# EasyEDA schematic 1-Schematic_PCB__Board.json
TITLE: Project Red Fir; REV: 1.0; Date: 2025-08-22; Sheet: 1/1; Drawn By: Youness; Company: semiQa
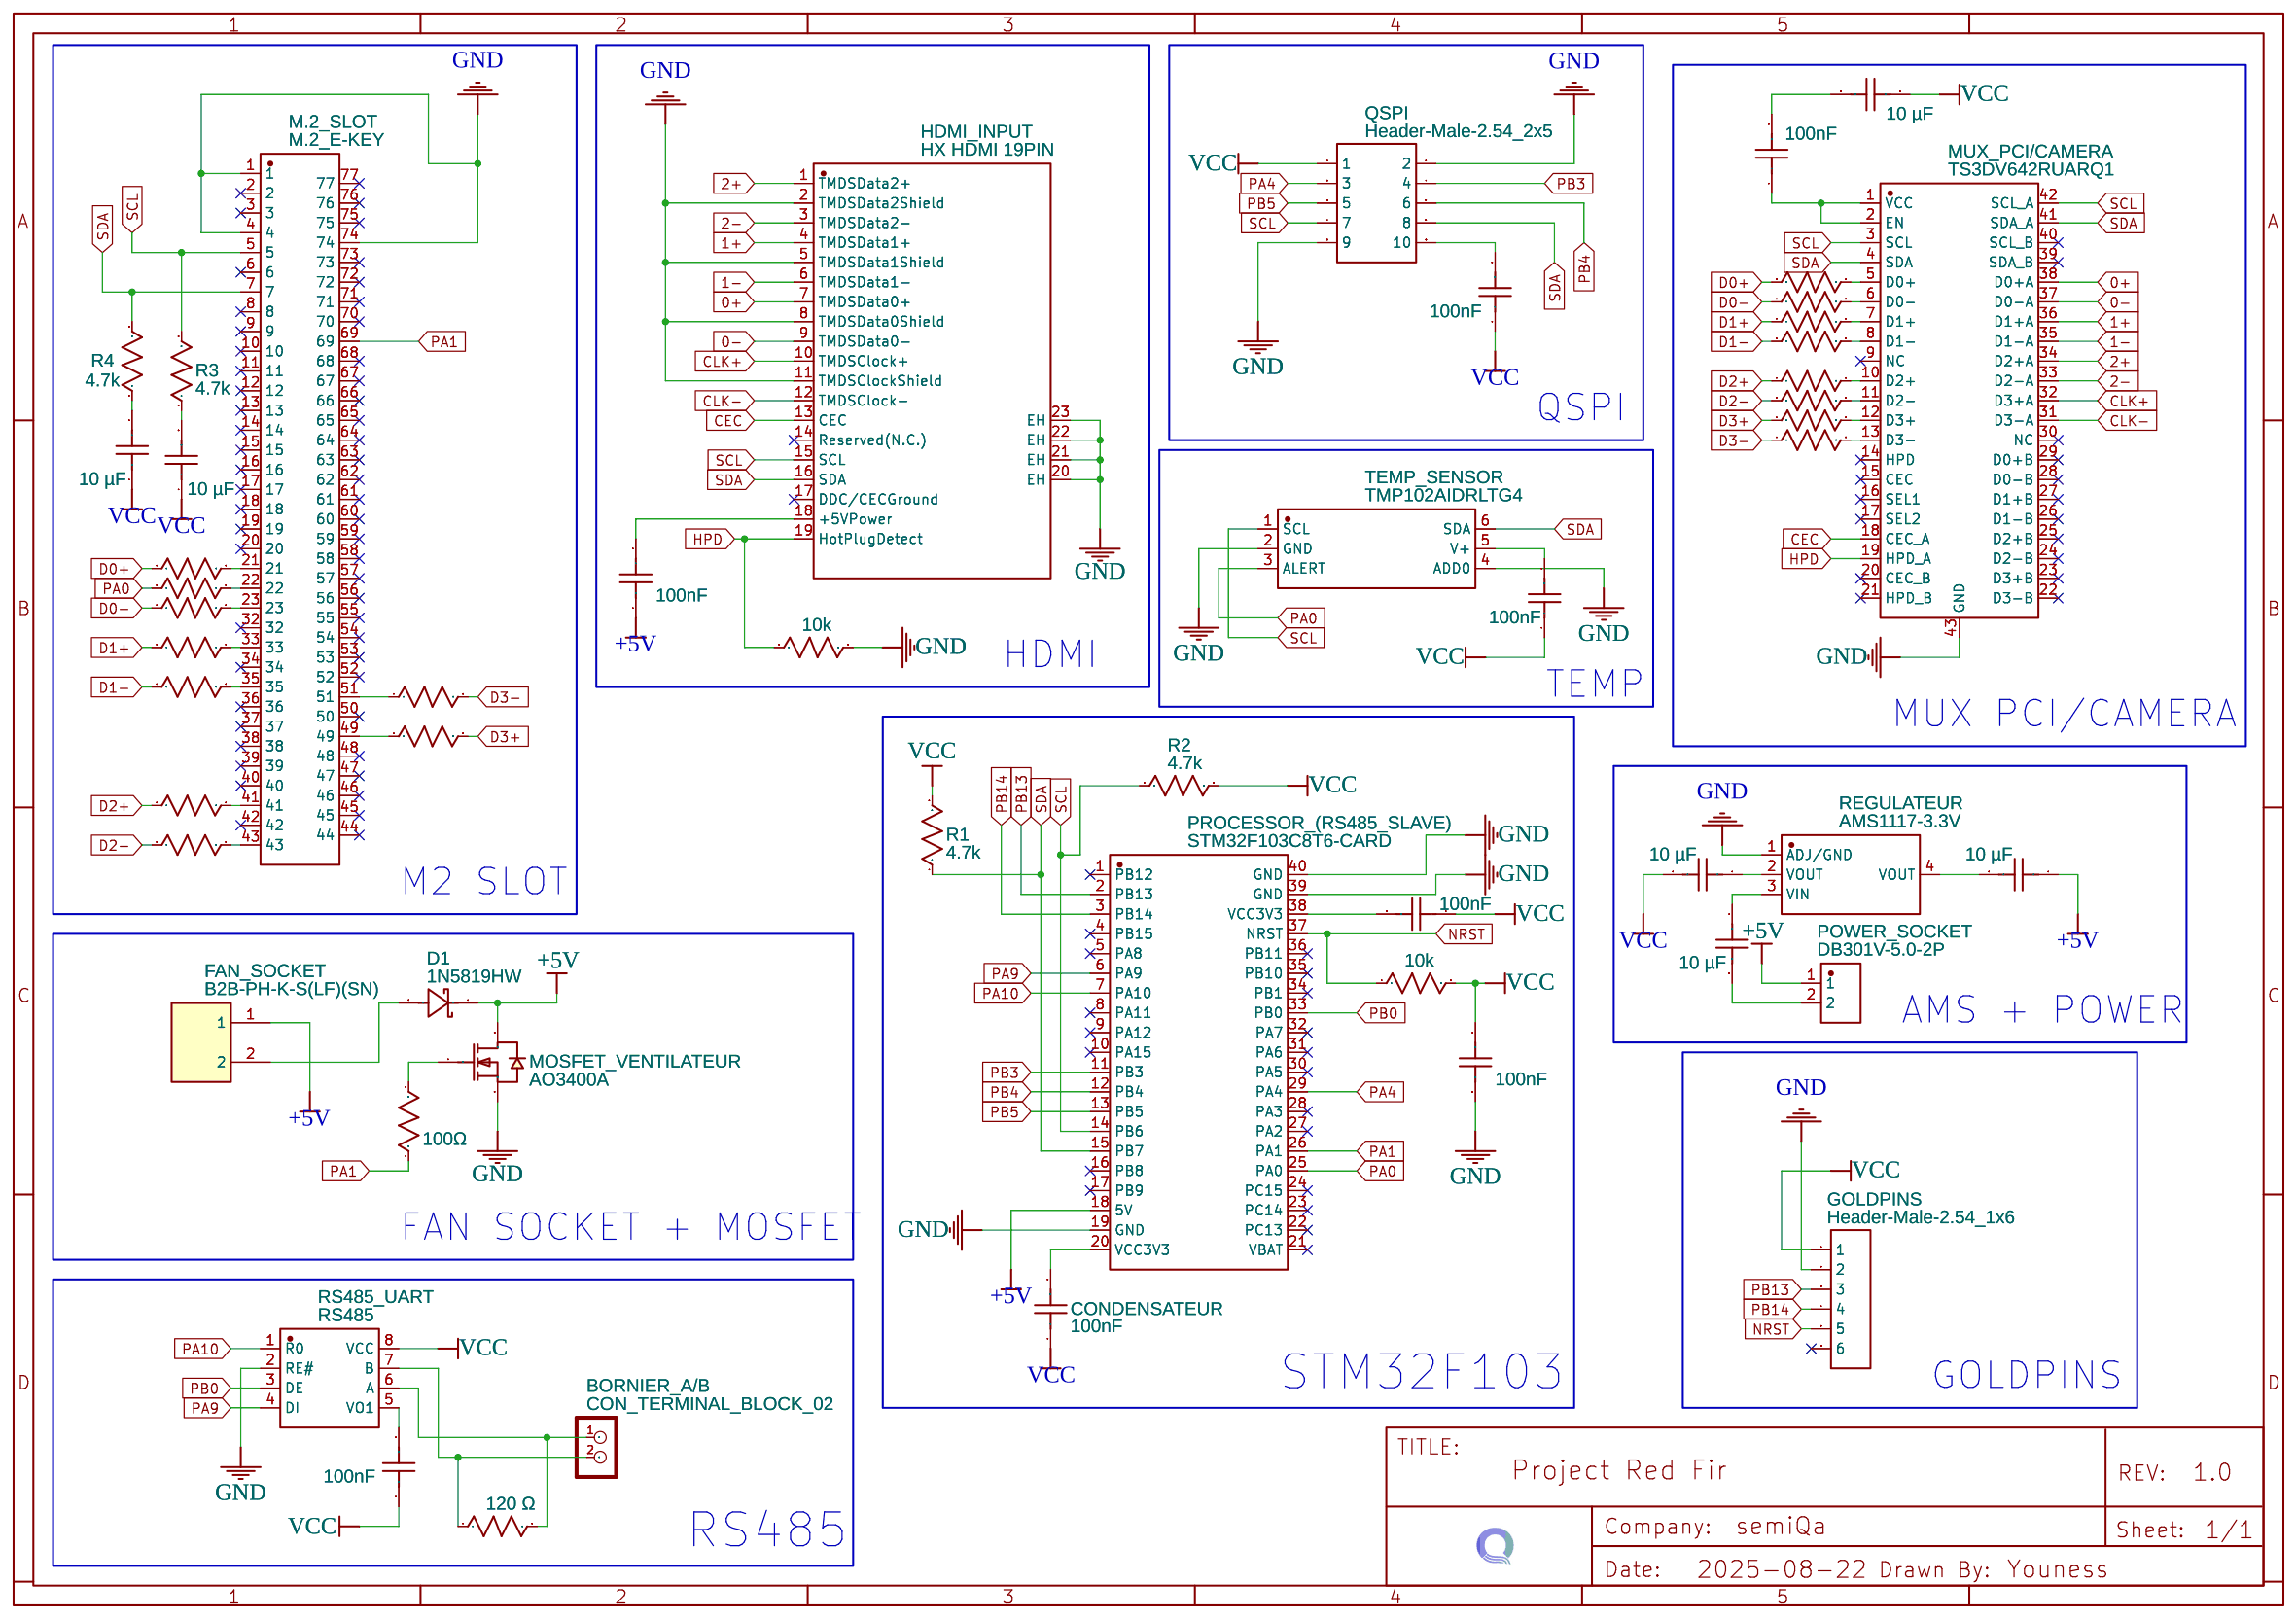
[diagram p0: schematic sheet]

## Parts
BORNIER_A/B  CON_TERMINAL_BLOCK_02  [TERMINAL_BLOCK_2P_5]
CONDENSATEUR  100nF  [C0805]
CONDENSATEUR1  100nF  [C0805]
CONDENSATEUR2  100nF  [C0805]
CONDENSATEUR3  100nF  [C0805]
CONDENSATEUR4  100nF  [C0805]
CONDENSATEUR5  100nF  [C0805]
CONDENSATEUR6  10 µF  [C0805]
CONDENSATEUR7  10 µF  [C0805]
CONDENSATEUR8  10 µF  [C0805]
CONDENSATEUR9  10 µF  [C0805]
CONDENSATEUR10  10 µF  [C0805]
CONDENSATEUR11  100nF  [C0805]
CONDENSATEUR12  10 µF  [C0805]
CONDENSATEUR13  100nF  [C0805]
D1  1N5819HW  [SOD-123_L2.7-W1.6-LS3.7-RD-1]
FAN_SOCKET  B2B-PH-K-S(LF)(SN)  [CONN-TH_B2B-PH-K-S]
GOLDPINS  Header-Male-2.54_1x6  [HDR-TH_6P-P2.54-V-M-1]
HDMI_INPUT  HX HDMI 19PIN  [HDMI-SMD_HX-HDMI-19PIN]
M.2_SLOT  M.2_E-KEY  [CONN-SMD_M.2_E-KEY]
MOSFET_VENTILATEUR  AO3400A  [SOT-23-3_L2.9-W1.3-P1.90-LS2.4-BR]
MUX_PCI/CAMERA  TS3DV642RUARQ1  [WQFN-42_L9.0-W3.5-P0.50-BL-EP]
POWER_SOCKET  DB301V-5.0-2P  [CONN-TH_2P-P5.00_L7.6-W10.0]
PROCESSOR_(RS485_SLAVE)  STM32F103C8T6-CARD  [CONN-TH_L53.3-W22.9_STM32F103C8T6-CARD]
QSPI  Header-Male-2.54_2x5  [HDR-TH_10P-P2.54-V-M-R2-C5-S2.54]
R1  4.7k  [R0603]
R2  4.7k  [R0603]
R3  4.7k  [R0603]
R4  4.7k  [R0603]
R5  10k  [R0603]
R6  10k  [R0603]
R7  100Ω  [R0603]
R8  33 Ω  [R0603]
R9  33 Ω  [R0603]
R10  33 Ω  [R0603]
R11  33 Ω  [R0603]
R12  33 Ω  [R0603]
R13  33 Ω  [R0603]
R14  33 Ω  [R0603]
R15  33 Ω  [R0603]
R16  33 Ω  [R0603]
R17  120 Ω  [R0603]
R18  33 Ω  [R0603]
R19  33 Ω  [R0603]
R20  33 Ω  [R0603]
R21  33 Ω  [R0603]
R22  33 Ω  [R0603]
R23  33 Ω  [R0603]
R24  33 Ω  [R0603]
R25  33 Ω  [R0603]
REGULATEUR  AMS1117-3.3V  [SOT-223-4_L6.5-W3.5-P2.30-LS7.0-BR]
RS485_UART  RS485  [SOP-8_L4.9-W3.9-P1.27-LS6.0-BL]
TEMP_SENSOR  TMP102AIDRLTG4  [SOT-563_L1.6-W1.2-P0.50-LS1.6-BR]

## Library data of the parts
BORNIER_A/B = CON_TERMINAL_BLOCK_02: Contributor: DangerousPrototype
CONDENSATEUR CONDENSATEUR1-CONDENSATEUR13 = CC0805KRX7R9BB104: Supplier: LCSC; Manufacturer: YAGEO(国巨); Supplier Part: C49678; JLCPCB Part Class: Basic Part
D1 = 1N5819HW: Contributor: LCSC; Supplier: LCSC; Supplier Part: C2905649; Manufacturer: TECH PUBLIC(台舟); JLCPCB Part Class: Extended Part
FAN_SOCKET = B2B-PH-K-S(LF)(SN): Contributor: LCSC; Supplier: LCSC; Manufacturer: JST; Supplier Part: C131337; JLCPCB Part Class: Extended Part
GOLDPINS = Header-Male-2.54_1x6: Supplier: LCSC; Manufacturer: BOOMELE(博穆精密); Manufacturer Part: 2.54-1x6P直针; Supplier Part: C37208; JLCPCB Part Class: Extended Part
HDMI_INPUT = HX HDMI 19PIN: Contributor: lcsc; Supplier: LCSC; Supplier Part: C5184845; Manufacturer: hanxia(韩下); JLCPCB Part Class: Extended Part
M.2_SLOT = M.2_E-KEY: Contributor: LCSC; Supplier: LCSC; Supplier Part: C9900010437; Manufacturer: null; JLCPCB Part Class: Extended Part
MOSFET_VENTILATEUR = AO3400A: Supplier: LCSC; Manufacturer: AOS; Supplier Part: C20917; JLCPCB Part Class: Basic Part
MUX_PCI/CAMERA = TS3DV642RUARQ1: Contributor: lcsc; Supplier: LCSC; Supplier Part: C3226205; Manufacturer: TI(德州仪器); JLCPCB Part Class: Extended Part
POWER_SOCKET = DB301V-5.0-2P: Contributor: LCSC; Supplier: LCSC; Supplier Part: C395882; Manufacturer: DORABO(地博电气); Manufacturer Part: DB301V-5.0-2P-BU-S; JLCPCB Part Class: Extended Part
PROCESSOR_(RS485_SLAVE) = STM32F103C8T6-CARD: Supplier: LCSC; Supplier Part: C9900077949; Manufacturer: null; Manufacturer Part: STM32F103C8T6-Card; Contributor: lcsc
QSPI = Header-Male-2.54_2x5: Supplier: LCSC; Manufacturer Part: 2*5p排针 2.54mm; Supplier Part: C28207; JLCPCB Part Class: Extended Part; Manufacturer: null
R1-R25 = R_0603_US: Contributor: LCEDA_Lib
REGULATEUR = AMS1117-3.3V: Contributor: LCSC; Supplier: LCSC; Supplier Part: C2688239; Manufacturer: WPMtek(维攀); JLCPCB Part Class: Extended Part
RS485_UART = RS485: Supplier: LCSC; Supplier Part: C19631832; Manufacturer: GR(国睿); JLCPCB Part Class: Extended Part; Contributor: lcsc
TEMP_SENSOR = TMP102AIDRLTG4: Supplier: LCSC; Supplier Part: C6885681; Manufacturer: TI(德州仪器); Contributor: lcsc

## Nets
+5V: CONDENSATEUR8.1 CONDENSATEUR11.1 D1.1(K) FAN_SOCKET.1 MOSFET_VENTILATEUR.3(D) POWER_SOCKET.1 PROCESSOR_(RS485_SLAVE).18(5V)
GND: CONDENSATEUR5.2 GOLDPINS.2 HDMI_INPUT.2(TMDSData2Shield) HDMI_INPUT.5(TMDSData1Shield) HDMI_INPUT.8(TMDSData0Shield) HDMI_INPUT.11(TMDSClockShield) HDMI_INPUT.20(EH) HDMI_INPUT.21(EH) HDMI_INPUT.22(EH) HDMI_INPUT.23(EH) M.2_SLOT.1 M.2_SLOT.4 M.2_SLOT.74 MOSFET_VENTILATEUR.2(S) MUX_PCI/CAMERA.43(GND) PROCESSOR_(RS485_SLAVE).19(GND) PROCESSOR_(RS485_SLAVE).39(GND) PROCESSOR_(RS485_SLAVE).40(GND) QSPI.2 QSPI.9 R6.2 REGULATEUR.1(ADJ/GND) RS485_UART.2(RE#) TEMP_SENSOR.2(GND) TEMP_SENSOR.4(ADD0)
VCC: CONDENSATEUR.1 CONDENSATEUR1.1 CONDENSATEUR3.1 CONDENSATEUR4.1 CONDENSATEUR5.1 CONDENSATEUR6.1 CONDENSATEUR7.1 CONDENSATEUR9.2 CONDENSATEUR12.1 CONDENSATEUR13.1 GOLDPINS.1 QSPI.1 R1.2 R2.2 R5.2 RS485_UART.8(VCC)
0+: HDMI_INPUT.7(TMDSData0+) MUX_PCI/CAMERA.38(D0+A)
0-: HDMI_INPUT.9(TMDSData0-) MUX_PCI/CAMERA.37(D0-A)
1+: HDMI_INPUT.4(TMDSData1+) MUX_PCI/CAMERA.36(D1+A)
1-: HDMI_INPUT.6(TMDSData1-) MUX_PCI/CAMERA.35(D1-A)
2+: HDMI_INPUT.1(TMDSData2+) MUX_PCI/CAMERA.34(D2+A)
2-: HDMI_INPUT.3(TMDSData2-) MUX_PCI/CAMERA.33(D2-A)
CEC: HDMI_INPUT.13(CEC) MUX_PCI/CAMERA.18(CEC_A)
CLK+: HDMI_INPUT.10(TMDSClock+) MUX_PCI/CAMERA.32(D3+A)
CLK-: HDMI_INPUT.12(TMDSClock-) MUX_PCI/CAMERA.31(D3-A)
D0+: R8.1 R18.2
D0-: R10.1 R19.1
D1+: R11.1 R20.1
D1-: R12.1 R21.1
D2+: R15.1 R22.1
D2-: R16.1 R23.1
D3+: R14.2 R24.1
D3-: R13.2 R25.1
HPD: HDMI_INPUT.19(HotPlugDetect) MUX_PCI/CAMERA.19(HPD_A) R6.1
NRST: GOLDPINS.5 PROCESSOR_(RS485_SLAVE).37(NRST) R5.1
PA0: PROCESSOR_(RS485_SLAVE).25(PA0) R9.1 TEMP_SENSOR.3(ALERT)
PA1: M.2_SLOT.69 PROCESSOR_(RS485_SLAVE).26(PA1) R7.1
PA4: PROCESSOR_(RS485_SLAVE).29(PA4) QSPI.3
PA9: PROCESSOR_(RS485_SLAVE).6(PA9) RS485_UART.4(DI)
PA10: PROCESSOR_(RS485_SLAVE).7(PA10) RS485_UART.1(R0)
PB0: PROCESSOR_(RS485_SLAVE).33(PB0) RS485_UART.3(DE)
PB3: PROCESSOR_(RS485_SLAVE).11(PB3) QSPI.4
PB4: PROCESSOR_(RS485_SLAVE).12(PB4) QSPI.6
PB5: PROCESSOR_(RS485_SLAVE).13(PB5) QSPI.5
PB13: GOLDPINS.3 PROCESSOR_(RS485_SLAVE).2(PB13)
PB14: GOLDPINS.4 PROCESSOR_(RS485_SLAVE).3(PB14)
SCL: HDMI_INPUT.15(SCL) M.2_SLOT.5 MUX_PCI/CAMERA.3(SCL) MUX_PCI/CAMERA.42(SCL_A) PROCESSOR_(RS485_SLAVE).14(PB6) QSPI.7 R2.1 R3.2 TEMP_SENSOR.1(SCL)
SDA: HDMI_INPUT.16(SDA) M.2_SLOT.7 MUX_PCI/CAMERA.4(SDA) MUX_PCI/CAMERA.41(SDA_A) PROCESSOR_(RS485_SLAVE).15(PB7) QSPI.8 R1.1 R4.2 TEMP_SENSOR.6(SDA)
Net-(BORNIER_A/B-1): BORNIER_A/B.1 R17.2 RS485_UART.6(A)
Net-(BORNIER_A/B-2): BORNIER_A/B.2 R17.1 RS485_UART.7(B)
Net-(CONDENSATEUR1-2): CONDENSATEUR1.2 QSPI.10
Net-(CONDENSATEUR2-1): CONDENSATEUR2.1 MUX_PCI/CAMERA.1(VCC) MUX_PCI/CAMERA.2(EN)
Net-(CONDENSATEUR2-2): CONDENSATEUR2.2 CONDENSATEUR12.2
Net-(CONDENSATEUR3-2): CONDENSATEUR3.2 TEMP_SENSOR.5(V+)
Net-(CONDENSATEUR4-2): CONDENSATEUR4.2 PROCESSOR_(RS485_SLAVE).38(VCC3V3)
Net-(CONDENSATEUR6-2): CONDENSATEUR6.2 R4.1
Net-(CONDENSATEUR7-2): CONDENSATEUR7.2 R3.1
Net-(CONDENSATEUR8-2): CONDENSATEUR8.2 REGULATEUR.4(VOUT)
Net-(CONDENSATEUR9-1): CONDENSATEUR9.1 REGULATEUR.2(VOUT)
Net-(CONDENSATEUR10-1): CONDENSATEUR10.1 REGULATEUR.3(VIN)
Net-(CONDENSATEUR10-2): CONDENSATEUR10.2 POWER_SOCKET.2
Net-(CONDENSATEUR11-2): CONDENSATEUR11.2 HDMI_INPUT.18(+5VPower)
Net-(CONDENSATEUR13-2): CONDENSATEUR13.2 RS485_UART.5(VO1)
Net-(CONDENSATEUR-2): CONDENSATEUR.2 PROCESSOR_(RS485_SLAVE).20(VCC3V3)
Net-(D1-2): D1.2(A) FAN_SOCKET.2
Net-(M.2_SLOT-21): M.2_SLOT.21 R8.2
Net-(M.2_SLOT-22): M.2_SLOT.22 R9.2
Net-(M.2_SLOT-23): M.2_SLOT.23 R10.2
Net-(M.2_SLOT-33): M.2_SLOT.33 R11.2
Net-(M.2_SLOT-35): M.2_SLOT.35 R12.2
Net-(M.2_SLOT-41): M.2_SLOT.41 R15.2
Net-(M.2_SLOT-43): M.2_SLOT.43 R16.2
Net-(M.2_SLOT-49): M.2_SLOT.49 R14.1
Net-(M.2_SLOT-51): M.2_SLOT.51 R13.1
Net-(MOSFET_VENTILATEUR-1): MOSFET_VENTILATEUR.1(G) R7.2
Net-(MUX_PCI/CAMERA-5): MUX_PCI/CAMERA.5(D0+) R18.1
Net-(MUX_PCI/CAMERA-6): MUX_PCI/CAMERA.6(D0-) R19.2
Net-(MUX_PCI/CAMERA-7): MUX_PCI/CAMERA.7(D1+) R20.2
Net-(MUX_PCI/CAMERA-8): MUX_PCI/CAMERA.8(D1-) R21.2
Net-(MUX_PCI/CAMERA-10): MUX_PCI/CAMERA.10(D2+) R22.2
Net-(MUX_PCI/CAMERA-11): MUX_PCI/CAMERA.11(D2-) R23.2
Net-(MUX_PCI/CAMERA-12): MUX_PCI/CAMERA.12(D3+) R24.2
Net-(MUX_PCI/CAMERA-13): MUX_PCI/CAMERA.13(D3-) R25.2

Not connected (* = marked no-connect by the designer): GOLDPINS 6*; HDMI_INPUT 14(Reserved(N.C.))* 17(DDC/CECGround)*; M.2_SLOT 2* 3* 6* 8* 9* 10* 11* 12* 13* 14* 15* 16* 17* 18* 19* 20* 32* 34* 36* 37* 38* 39* 40* 42* 44* 45* 46* 47* 48* 50* 52* 53* 54* 55* 56* 57* 58* 59* 60* 61* 62* 63* 64* 65* 66* 67* 68* 70* 71* 72* 73* 75* 76* 77*; MUX_PCI/CAMERA 9(NC)* 14(HPD)* 15(CEC)* 16(SEL1)* 17(SEL2)* 20(CEC_B)* 21(HPD_B)* 22(D3-B)* 23(D3+B)* 24(D2-B)* 25(D2+B)* 26(D1-B)* 27(D1+B)* 28(D0-B)* 29(D0+B)* 30(NC)* 39(SDA_B)* 40(SCL_B)*; PROCESSOR_(RS485_SLAVE) 1(PB12)* 4(PB15)* 5(PA8)* 8(PA11)* 9(PA12)* 10(PA15)* 16(PB8)* 17(PB9)* 21(VBAT)* 22(PC13)* 23(PC14)* 24(PC15)* 27(PA2)* 28(PA3)* 30(PA5)* 31(PA6)* 32(PA7)* 34(PB1)* 35(PB10)* 36(PB11)*

## Notes on the sheet
- QSPI
- HDMI
- TEMP
- MUX PCI/CAMERA
- M2 SLOT
- AMS + POWER
- FAN SOCKET + MOSFET
- STM32F103
- GOLDPINS
- RS485
